# EAGLE design carteMere (EAGLE 5.10)
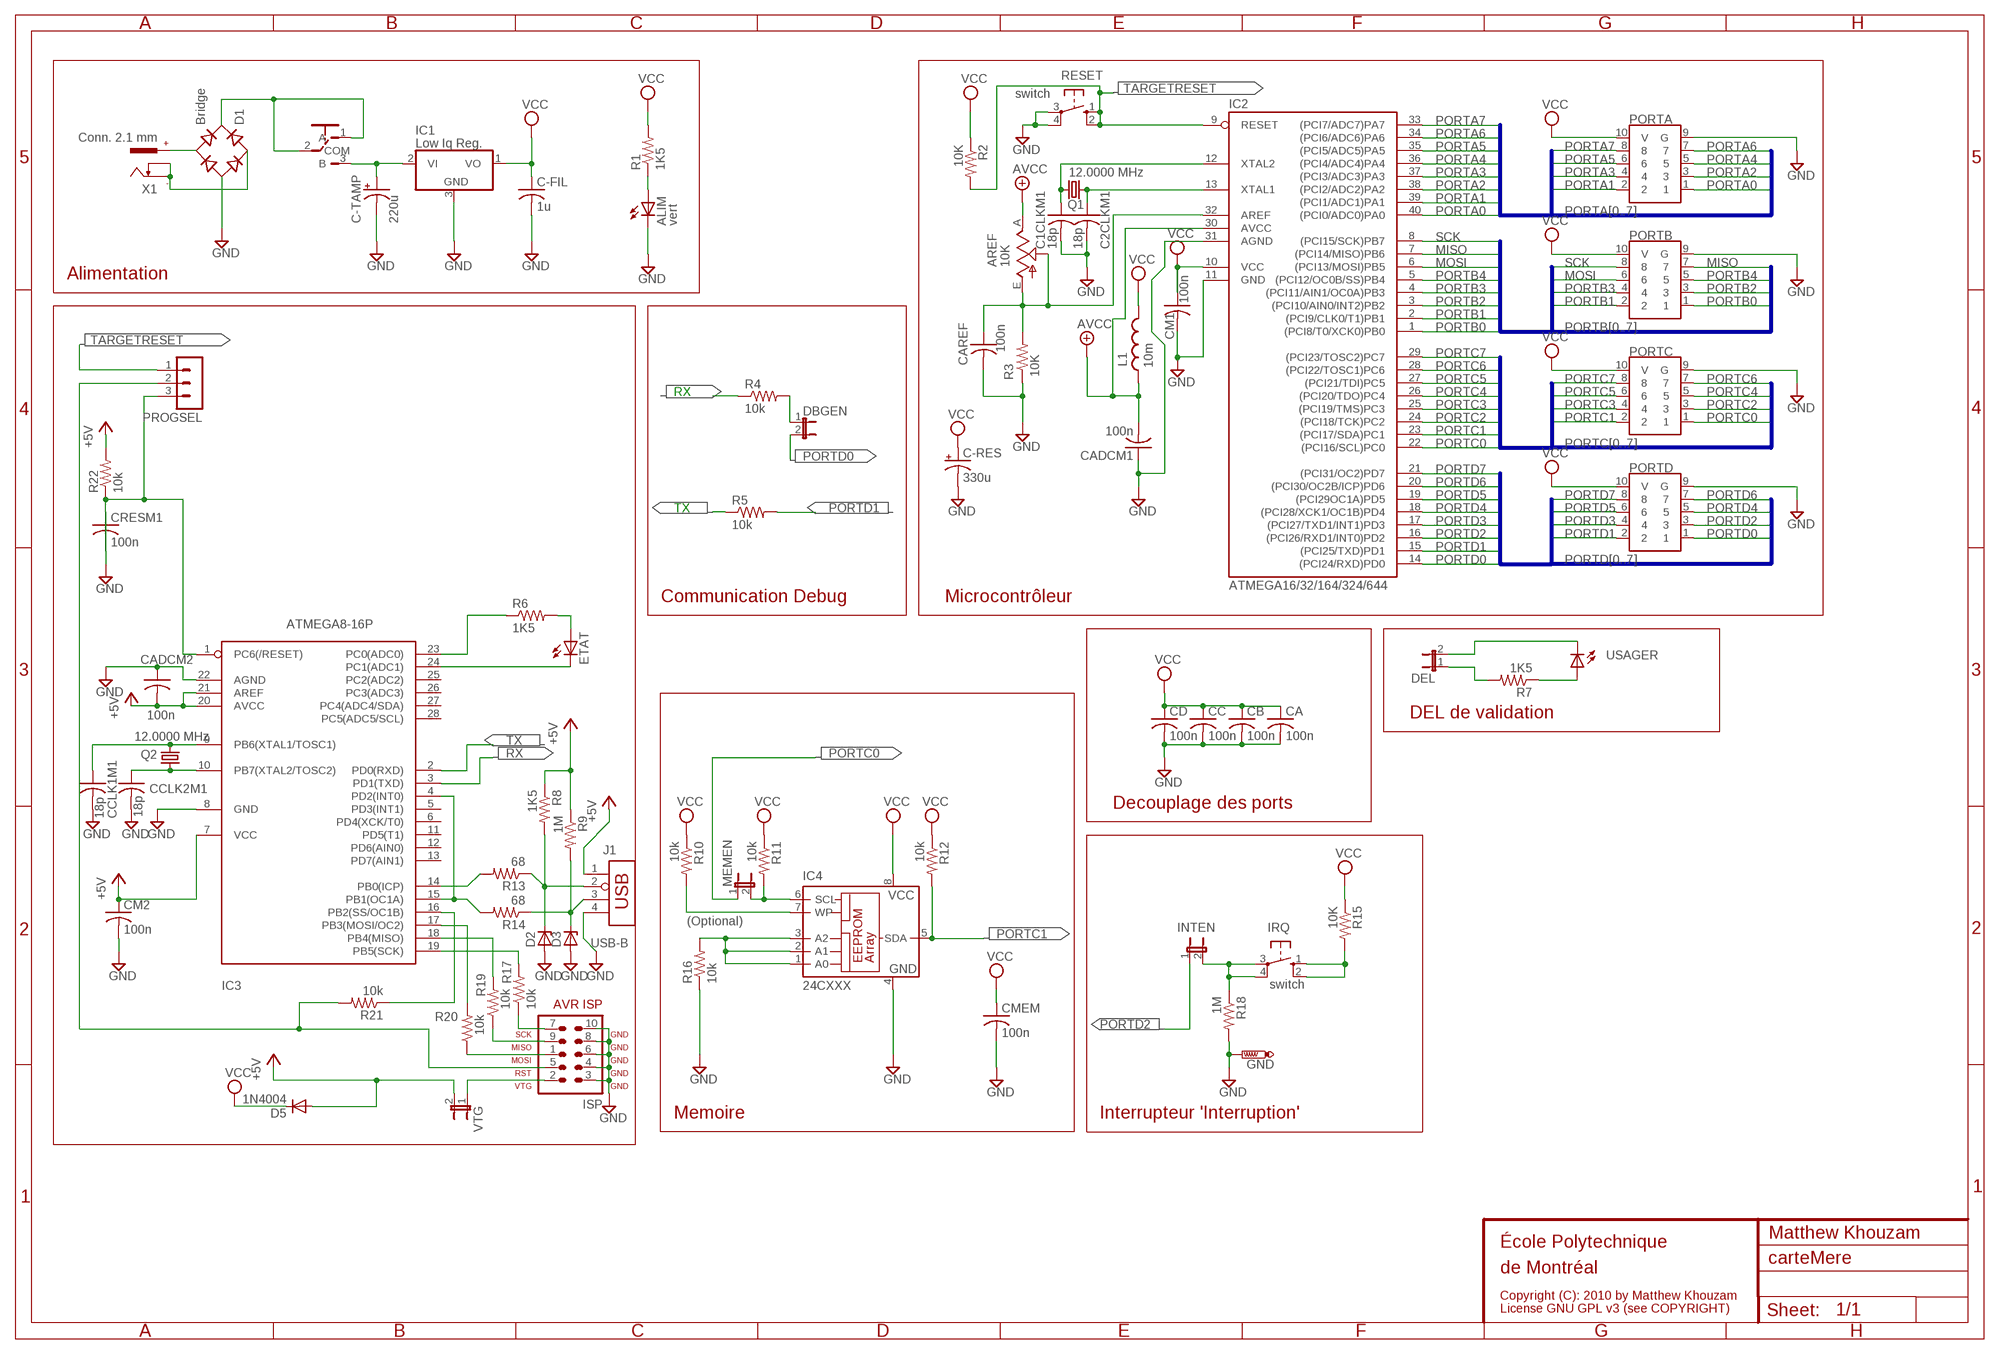
[diagram p0: schematic, sheet 1]

## Parts
ALIM  vert  LED5MM  [LED5MM]
AREF  10K  PV37SPEC  [S64Y]
C1CLKM1  18p  C-US050-035X075  [C050-035X075]
C2CLKM1  18p  C-US050-035X075  [C050-035X075]
C-FIL  1u  C-US050-035X075  [C050-035X075]
C-RES  330u  CPOL-USE2.5-7  [E2,5-7]
C-TAMP  220u  CPOL-USE3.5-8  [E3,5-8]
CA  100n  C-US050-035X075  [C050-035X075]
CADCM1  100n  C-US050-035X075  [C050-035X075]
CADCM2  100n  C-US050-035X075  [C050-035X075]
CAREF  100n  C-US050-035X075  [C050-035X075]
CB  100n  C-US050-035X075  [C050-035X075]
CC  100n  C-US050-035X075  [C050-035X075]
CCLK1M1  18p  C-US050-035X075  [C050-035X075]
CCLK2M1  18p  C-US050-035X075  [C050-035X075]
CD  100n  C-US050-035X075  [C050-035X075]
CM1  100n  C-US050-035X075  [C050-035X075]
CM2  100n  C-US050-035X075  [C050-035X075]
CMEM  100n  C-US050-035X075  [C050-035X075]
CRESM1  100n  C-US050-035X075  [C050-035X075]
D1  Bridge  RECTIFIER-DIL  [B-DIL]
D2  ZENER-DIODEDO35Z10  [DO35Z10]
D3  ZENER-DIODEDO35Z10  [DO35Z10]
D5  1N4004  [DO41-10]
DBGEN  JP1E  [JP1]
DEL  JP1E  [JP1]
ETAT  Bi-dir  LED5MM  [LED5MM]
GND  PTR1PAD1-13  [P1-13]
IC1  Low Iq Reg.  LP8345-50  [TO252]
IC2  ATMEGA16/32/164/324/644  ATMEGA324-20P  [DIL40]
IC3  ATMEGA8-16P  [DIL28-3]
IC4  24CXXX  24AA256P  [DIL8]
INTEN  JP1E  [JP1]
IRQ  switch  10-XX  [B3F-10XX]
ISP  AVR-ISP-10  [AVR-ISP-10]
J1  USB-B  [USB-B]
L1  10m  L-US0207/12  [0207/12]
MEMEN  JP1E  [JP1]
OFF/ON  EG1218  [3DIL]
PORTA  DATAPORT  [5X2]
PORTB  DATAPORT  [5X2]
PORTC  DATAPORT  [5X2]
PORTD  DATAPORT  [5X2]
PROGSEL  MA03-1  [MA03-1]
Q1  12.0000 MHz  CRYSTALHC49S  [HC49/S]
Q2  12.0000 MHz  CRYSTALHC49S  [HC49/S]
R1  1K5  R-US_0207/7  [0207/7]
R2  10K  R-US_0207/7  [0207/7]
R3  10K  R-US_0207/7  [0207/7]
R4  10k  R-US_0207/7  [0207/7]
R5  10k  R-US_0204/7  [0204/7]
R6  1K5  R-US_0207/7  [0207/7]
R7  1K5  R-US_0207/7  [0207/7]
R8  1K5  R-US_0207/7  [0207/7]
R9  1M  R-US_0207/7  [0207/7]
R10  10k  R-US_0207/7  [0207/7]
R11  10k  R-US_0207/7  [0207/7]
R12  10k  R-US_0207/7  [0207/7]
R13  68  R-US_0207/7  [0207/7]
R14  68  R-US_0207/7  [0207/7]
R15  10K  R-US_0207/7  [0207/7]
R16  10k  R-US_0207/7  [0207/7]
R17  10k  R-US_0204/7  [0204/7]
R18  1M  R-US_0207/7  [0207/7]
R19  10k  R-US_0204/7  [0204/7]
R20  10k  R-US_0204/7  [0204/7]
R21  10k  R-US_0204/7  [0204/7]
R22  10k  R-US_0207/7  [0207/7]
RESET  switch  10-XX  [B3F-10XX]
USAGER  Bi-dir  LED5MM  [LED5MM]
VTG  JP1E  [JP1]
X1  Conn. 2.1 mm  POWER21  [POWER21]

## Nets
+5V: CADCM2.2 CM2.1 D5.A IC3.7(VCC) IC3.20(AVCC) IC3.21(AREF) J1.1 R8.1 R9.1 R22.2 VTG.2
AVCC: AREF.A CADCM1.2 IC2.30(AVCC) L1.1
AVRRESET: IC3.16(PB2(SS/OC1B)) R21.1
D+: D3.C J1.3 R9.2 R14.1
D-: D2.C J1.2 R8.2 R13.1
DIAGLEG: R7.1 USAGER.A
DIODESW: D1.+ OFF/ON.1(A) OFF/ON.2(COM)
GND: ALIM.K(C) C1CLKM1.2 C2CLKM1.2 C-FIL.2 C-RES.- C-TAMP.- CA.2 CADCM1.1 CADCM2.1 CAREF.2 CB.2 CC.2 CCLK1M1.2 CCLK2M1.2 CD.2 CM1.2 CM2.2 CMEM.2 CRESM1.1 D1.- D2.A D3.A GND.1(TP) IC1.3(GND) IC2.11(GND) IC2.31(AGND) IC3.8(GND) IC3.22(AGND) IC4.4(GND) ISP.3 ISP.4 ISP.6 ISP.8 ISP.10 J1.4 PORTA.9(G) PORTB.9(G) PORTC.9(G) PORTD.9(G) R3.1 R16.1 R18.2 RESET.3(P) RESET.4(P1)
INTSW: IRQ.1(S) IRQ.2(S1) R15.2
INTSW2: INTEN.2 IRQ.3(P) IRQ.4(P1) R18.1
LEDTEST: DEL.2 USAGER.K(C)
MEGAAREF: AREF.E(B) AREF.S(W) CAREF.1 IC2.32(AREF) R3.2
MEGAXTAL1: C2CLKM1.1 IC2.13(XTAL1) Q1.2
MEGAXTAL2: C1CLKM1.1 IC2.12(XTAL2) Q1.1
MISO: IC2.7((PCI14/MISO)PB6) ISP.9 PORTB.7 R19.1
MISOUSB: IC3.18(PB4(MISO)) R19.2
MOSI: IC2.6((PCI13/MOSI)PB5) ISP.1 PORTB.6 R20.1
MOSIUSB: IC3.17(PB3(MOSI/OC2)) R20.2
N$8: CCLK2M1.1 IC3.10(PB7(XTAL2/TOSC2)) Q2.1
N$9: CCLK1M1.1 IC3.9(PB6(XTAL1/TOSC1)) Q2.2
N$12: IC4.1(A0) IC4.2(A1) IC4.3(A2) R16.2
N$17: ETAT.A R6.2
N$18: ETAT.K(C) IC3.24(PC1(ADC1))
N$19: IC3.23(PC0(ADC0)) R6.1
N$20: IC4.7(WP) R10.2
PORTA0: IC2.40((PCI0/ADC0)PA0) PORTA.1
PORTA1: IC2.39((PCI1/ADC1)PA1) PORTA.2
PORTA2: IC2.38((PCI2/ADC2)PA2) PORTA.3
PORTA3: IC2.37((PCI3/ADC3)PA3) PORTA.4
PORTA4: IC2.36((PCI4/ADC4)PA4) PORTA.5
PORTA5: IC2.35((PCI5/ADC5)PA5) PORTA.6
PORTA6: IC2.34((PCI6/ADC6)PA6) PORTA.7
PORTA7: IC2.33((PCI7/ADC7)PA7) PORTA.8
PORTB0: IC2.1((PCI8/T0/XCK0)PB0) PORTB.1
PORTB1: IC2.2((PCI9/CLK0/T1)PB1) PORTB.2
PORTB2: IC2.3((PCI10/AIN0/INT2)PB2) PORTB.3
PORTB3: IC2.4((PCI11/AIN1/OC0A)PB3) PORTB.4
PORTB4: IC2.5((PCI12/OC0B/SS)PB4) PORTB.5
PORTC0: IC2.22((PCI16/SCL)PC0) MEMEN.1 PORTC.1
PORTC1: IC2.23((PCI17/SDA)PC1) IC4.5(SDA) PORTC.2 R12.2
PORTC2: IC2.24((PCI18/TCK)PC2) PORTC.3
PORTC3: IC2.25((PCI19/TMS)PC3) PORTC.4
PORTC4: IC2.26((PCI20/TDO)PC4) PORTC.5
PORTC5: IC2.27((PCI21/TDI)PC5) PORTC.6
PORTC6: IC2.28((PCI22/TOSC1)PC6) PORTC.7
PORTC7: IC2.29((PCI23/TOSC2)PC7) PORTC.8
PORTD0: DBGEN.2 IC2.14((PCI24/RXD)PD0) PORTD.1
PORTD1: IC2.15((PCI25/TXD)PD1) PORTD.2 R5.2
PORTD2: IC2.16((PCI26/RXD1/INT0)PD2) INTEN.1 PORTD.3
PORTD3: IC2.17((PCI27/TXD1/INT1)PD3) PORTD.4
PORTD4: IC2.18((PCI28/XCK1/OC1B)PD4) PORTD.5
PORTD5: IC2.19((PCI29OC1A)PD5) PORTD.6
PORTD6: IC2.20((PCI30/OC2B/ICP)PD6) PORTD.7
PORTD7: IC2.21((PCI31/OC2)PD7) PORTD.8
PRGRESET: CRESM1.2 IC3.1(PC6(/RESET)) PROGSEL.3 R22.1
PWRLED: ALIM.A R1.1
RXD: IC3.2(PD0(RXD)) R5.1
SCK: IC2.8((PCI15/SCK)PB7) ISP.7 PORTB.8 R17.1
SCKUSB: IC3.19(PB5(SCK)) R17.2
SCL: IC4.6(SCL) MEMEN.2 R11.2
SYSRST: ISP.5 PROGSEL.2 R21.2
TARGETRESET: IC2.9(RESET) PROGSEL.1 R2.2 RESET.1(S) RESET.2(S1)
TL3: DEL.1 R7.2
TX: DBGEN.1 R4.2
TXD: IC3.3(PD1(TXD)) R4.1
USB+: IC3.4(PD2(INT0)) IC3.15(PB1(OC1A)) R14.2
USB-: IC3.14(PB0(ICP)) R13.2
VCC: C-FIL.1 C-RES.+ CA.1 CB.1 CC.1 CD.1 CM1.1 CMEM.1 D5.C IC1.1(VO) IC2.10(VCC) IC4.8(VCC) L1.2 PORTA.10(V) PORTB.10(V) PORTC.10(V) PORTD.10(V) R1.2 R2.1 R10.1 R11.1 R12.1 R15.1
VIN+: D1.AC2 X1.+
VIN-: D1.AC1 X1.- X1.C
VTG: ISP.2 VTG.1
VUNREG: C-TAMP.+ IC1.2(VI) OFF/ON.3(B)
Unconnected: IC3.5(PD3(INT1)) IC3.6(PD4(XCK/T0)) IC3.11(PD5(T1)) IC3.12(PD6(AIN0)) IC3.13(PD7(AIN1)) IC3.25(PC2(ADC2)) IC3.26(PC3(ADC3)) IC3.27(PC4(ADC4/SDA)) IC3.28(PC5(ADC5/SCL))

## Buses
PORTA[0..7]
PORTB[0..7]
PORTC[0..7]
PORTD[0..7]

## Notes on the sheet
- Alimentation
- RX
- TX
- Communication Debug | Microcontrôleur
- DEL de validation
- TX
- RX
- Decouplage des ports
- (Optional)
- Memoire | Interrupteur 'Interruption'
- Matthew Khouzam
- École Polytechnique
- de Montréal
- Copyright (C): 2010 by Matthew Khouzam
- License GNU GPL v3 (see COPYRIGHT)

## Library data of the parts
ALIM ETAT USAGER = led:LED: LED OSRAM: - CHIPLED LG R971, LG N971, LY N971, LG Q971, LY Q971, LO R971, LY R971 LH N974, LH R974 LS Q976, LO Q976, LY Q976 LO Q996 - Hyper CHIPLED LW Q18S LB Q993, LB Q99A, LB R99A - SideLED LS A670, LO A670, LY A670, LG A670, LP A670 LB A673, LV A673, LT A673, LW A673 LH A674 LY A675 LS A676, LA A676, LO A676, LY A676, LW A676 LS A679, LY A679, LG A679 - Hyper Micro SIDELED® LS Y876, LA Y876, LO Y876, LY Y876 LT Y87S - SmartLED LW L88C, LW L88S LB L89C, LB L89S, LG L890 LS L89K, LO L89K, LY L89K LS L896, LA L896, LO L896, LY L896 - TOPLED LS T670, LO T670, LY T670, LG T670, LP T670 LSG T670, LSP T670, LSY T670, LOP T670, LYG T670 LG T671, LOG T671, LSG T671 LB T673, LV T673, LT T673, LW T673 LH T674 LS T676, LA T676, LO T676, LY T676, LB T676, LH T676, LSB T676, LW T676 LB T67C, LV T67C, LT T67C, LS T67K, LO T67K, LY T67K, LW E67C LS E67B, LA E67B, LO E67B, LY E67B, LB E67C, LV E67C, LT E67C LW T67C LS T679, LY T679, LG T679 LS T770, LO T770, LY T770, LG T770, LP T770 LB T773, LV T773, LT T773, LW T773 LH T774 LS E675, LA E675, LY E675, LS T675 LS T776, LA T776, LO T776, LY T776, LB T776 LHGB T686 LT T68C, LB T68C - Hyper Mini TOPLED® LB M676 - Mini TOPLED Santana® LG M470 LS M47K, LO M47K, LY M47K Source: http://www.osram.convergy.de/
AREF = mblbr:PV37: Potentiomètre Murata série PV37
C1CLKM1 C2CLKM1 C-FIL CA CADCM1 CADCM2 CAREF CB CC CCLK1M1 CCLK2M1 CD CM1 CM2 CMEM CRESM1 = mblbr:C-US: CAPACITOR, American symbol
C-RES C-TAMP = rcl:CPOL-US: POLARIZED CAPACITOR, American symbol
D1 = rectifier:RECTIFIER-: Rectifier
D2 D3 = diode:ZENER-DIODE: Z-Diode
D5 = diode:1N4004: DIODE general purpose rectifier, 1 A
DBGEN DEL INTEN MEMEN VTG = jumper:JP1E: JUMPER
GND = testpad:PTR1: TEST PIN
IC1 = lp8345:LP8345-50
IC2 = avr:ATMEGA324*P: MICROCONTROLLER 32 kBytes FLASH 2 kBytes SRAM 1 kBytes EEPROM DUAL USART 8-channel 10 bit ADC
IC3 = avr:ATMEGA8*P: MICROCONTROLLER 8 Kbytes FLASH 1 kbytes SRAM 512 bytes EEPROM USART 4-channel 10 bit ADC 2-channel 8 bit ADC
IC4 = microchip:24*: Serial EEPROM I2C
IRQ RESET = mblbr:10-XX: OMRON SWITCH
ISP = atmel:AVR-ISP-10: AVR ISP-10 Serial Programming Header
J1 = mblbr:USB-B: USB Type B connector ASSMANN Electronics
L1 = rcl:L-US: INDUCTOR, American symbol
OFF/ON = eswitch:EG1218
PORTA PORTB PORTC PORTD = Connector:DATAPORT: this is a dataport Matthew Khouzam 2005
PROGSEL = con-lstb:MA03-1: PIN HEADER
Q1 Q2 = mblbr:CRYSTAL: CRYSTAL
R1-R22 = mblbr:R-US_: RESISTOR, American symbol
X1 = tennessee:POWER21: CONNECTOR

## Board
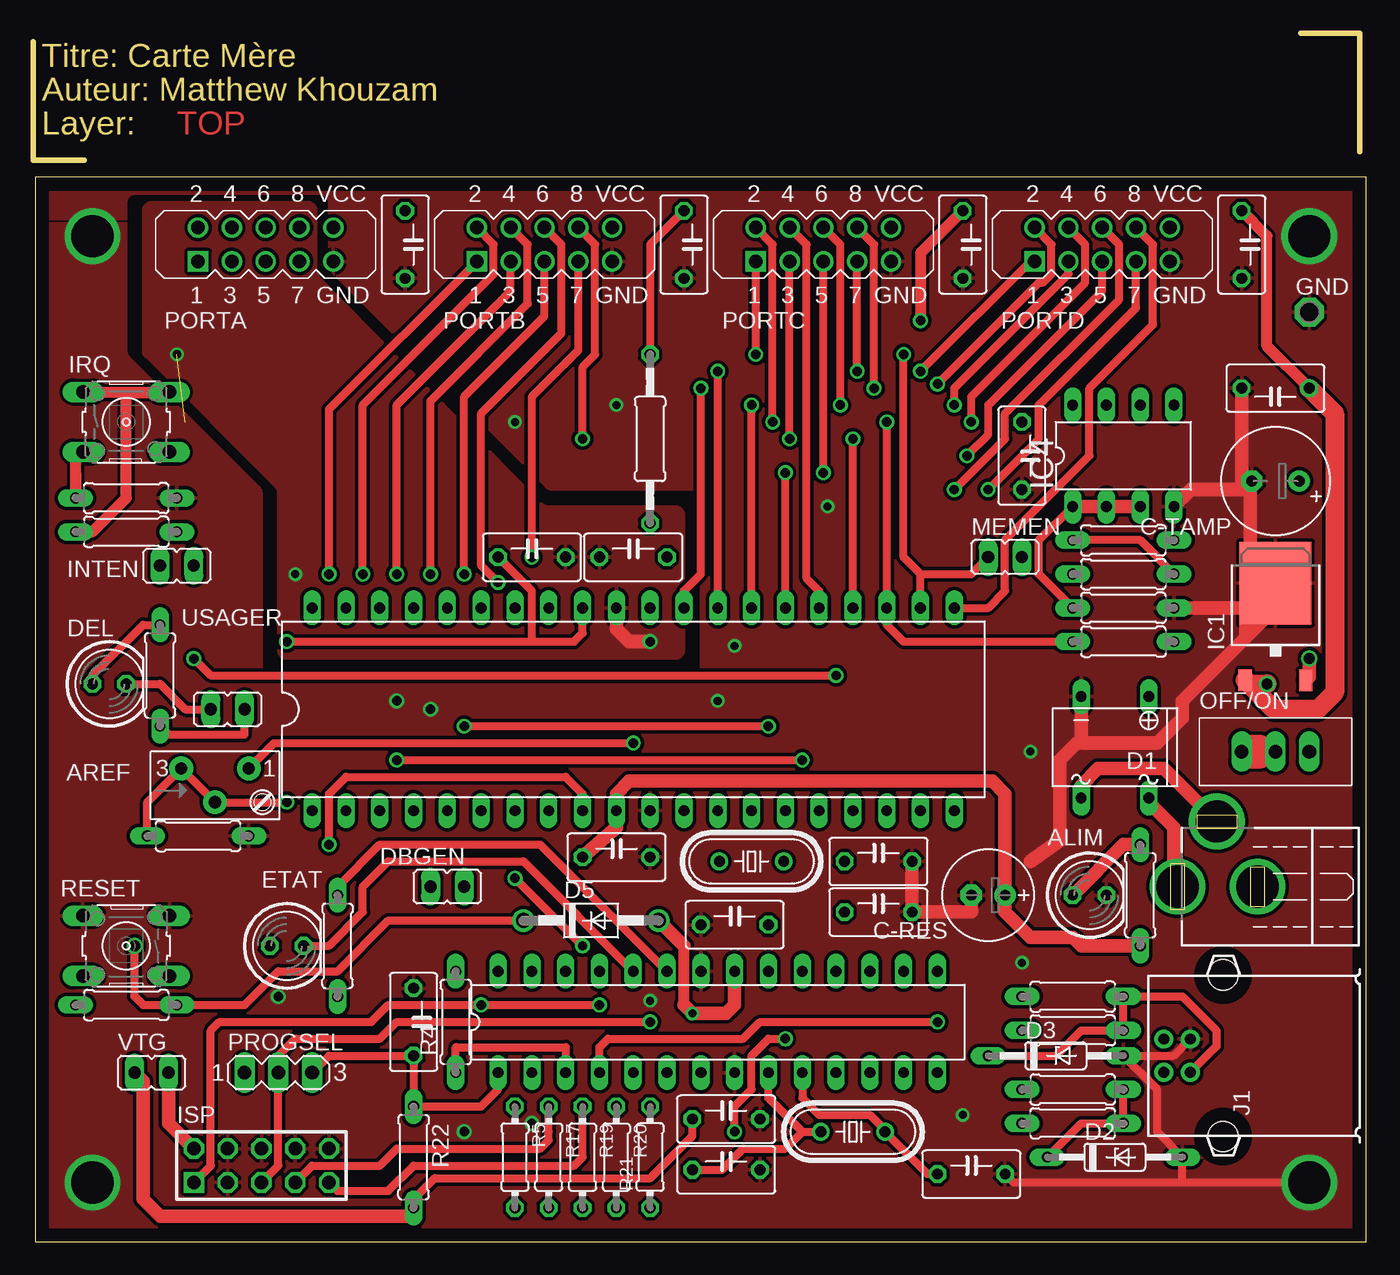
[diagram p1: board, top side]
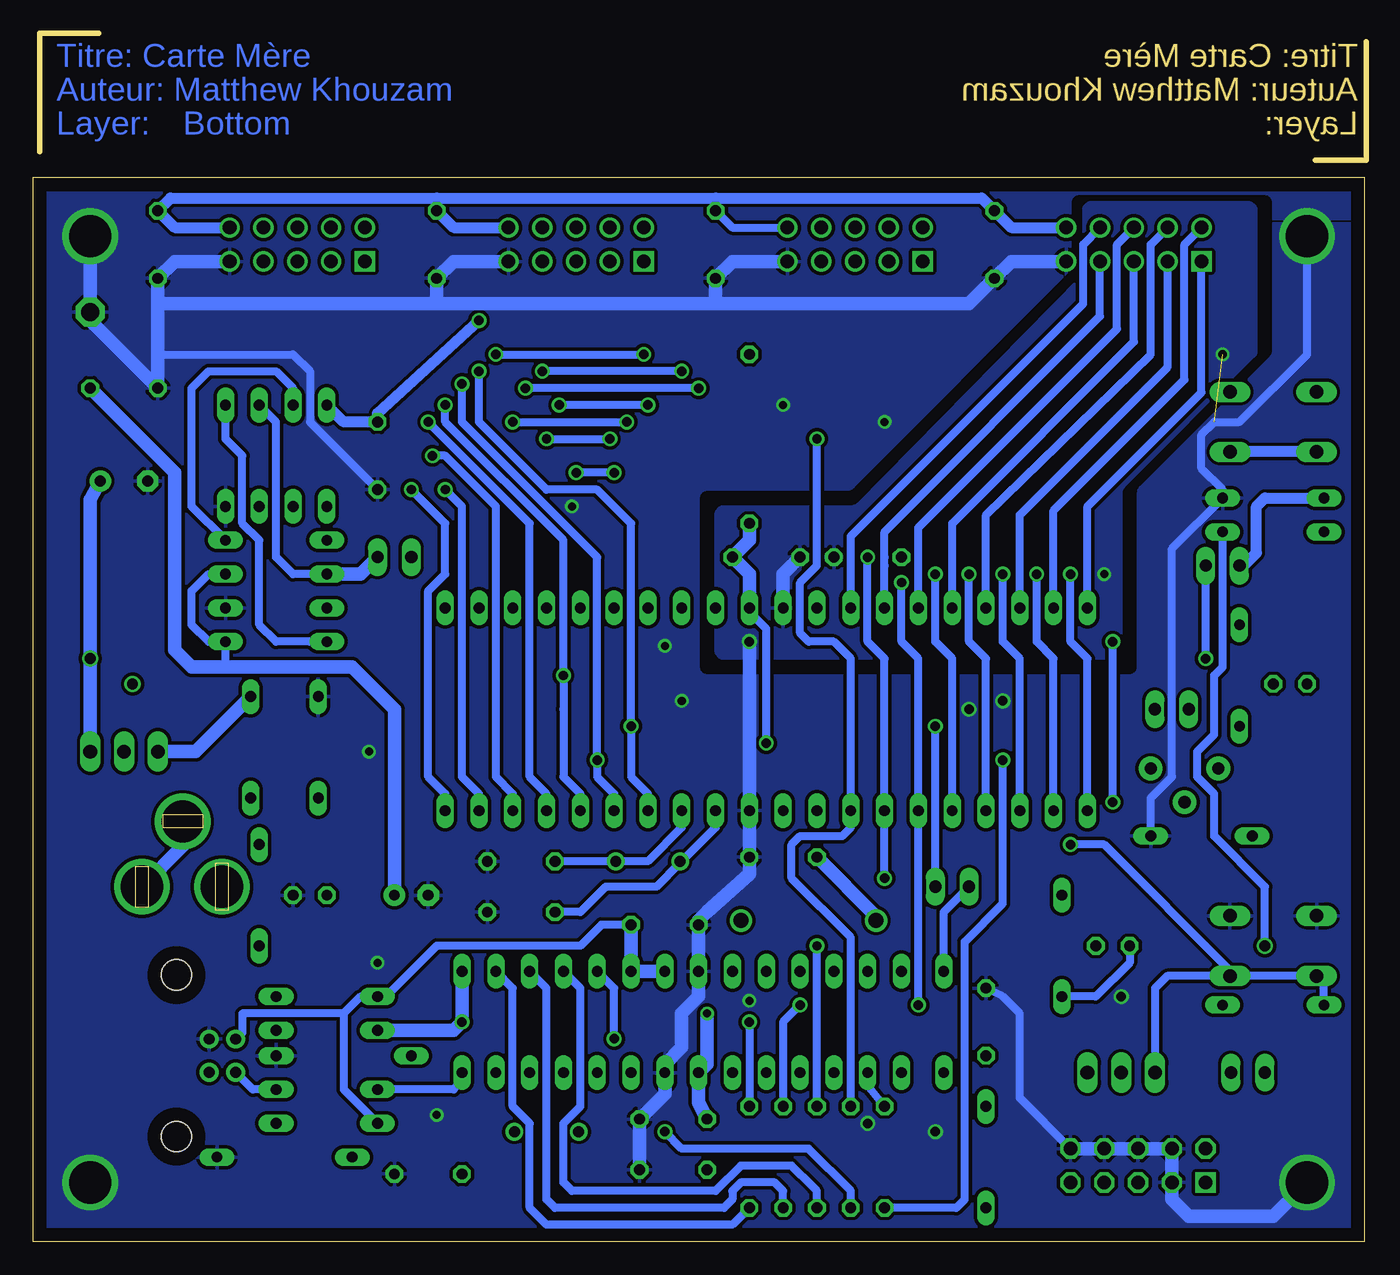
[diagram p2: board, bottom side, seen from below]

Size 100.17 x 90.8 mm. Coordinates in mm from the lower left corner, seen from the top.
Outline: 0,90.16 0,81.27 3.81,81.27
Outline: 99.7,81.91 99.7,90.8 95.25,90.8
Outline: 0.17,0 100.17,0 100.17,80 0.17,80 0.17,0
Copper layers (1*16): Top 0.035mm / dielectric 1.5mm / Bottom 0.035mm
Design rules "default *": minimum track width 10mil, minimum drill 24mil, track to track 6mil, track to pad 6mil, pad to pad 6mil, via to via 6mil, smd to smd 8mil, copper to edge 40mil, drill to drill 8mil, minimum pad ring 10mil, minimum via ring 8mil, stop-mask expansion 4mil, vias tented up to drill 0mil, thermal gap 10mil

### Footprints (pad centres in the part's own frame; a part is rotated, then mirrored left to right if it is on the bottom)
LED5MM = drill 0.813 octagon: A -1.27,0; K 1.27,0
S64Y = drill 0.914 pad 1.778 round: A 2.54,1.27; E -2.54,1.27; S 0,-1.27
C050-035X075 = drill 0.813 octagon: 1 -2.54,0; 2 2.54,0
E2,5-7 = drill 0.813 pad 1.6 round: + -1.27,0 | drill 0.813 pad 1.6 octagon: - 1.27,0
E3,5-8 = drill 0.813 pad 1.6 round: + -1.778,0 | drill 0.813 pad 1.6 octagon: - 1.778,0
B-DIL@1 = drill 0.813 long: + -2.54,-3.81; - 2.54,-3.81; AC1 2.54,3.81; AC2 -2.54,3.81
DO35Z10 = drill 0.813 long: A 5.08,0; C -5.08,0
DO41-10 = drill 1.118 round: A 5.08,0; C -5.08,0
JP1 = drill 0.914 long: 1 0,-1.27; 2 0,1.27
P1-13 = drill 1.321 pad 2.159 octagon: 1 0,0
TO252 = smd 1 x 1.6: 1 -2.28,-4.8; 2 2.28,-4.8 | smd 5.4 x 6.2: 3 0,2.5
DIL40 = drill 0.813 long: 1 -24.13,-7.62; 2 -21.59,-7.62; 3 -19.05,-7.62; 4 -16.51,-7.62; 5 -13.97,-7.62; 6 -11.43,-7.62; 7 -8.89,-7.62; 8 -6.35,-7.62; 9 -3.81,-7.62; 10 -1.27,-7.62; 11 1.27,-7.62; 12 3.81,-7.62; 13 6.35,-7.62; 14 8.89,-7.62; 15 11.43,-7.62; 16 13.97,-7.62; 17 16.51,-7.62; 18 19.05,-7.62; 19 21.59,-7.62; 20 24.13,-7.62; 21 24.13,7.62; 22 21.59,7.62; 23 19.05,7.62; 24 16.51,7.62; 25 13.97,7.62; 26 11.43,7.62; 27 8.89,7.62; 28 6.35,7.62; 29 3.81,7.62; 30 1.27,7.62; 31 -1.27,7.62; 32 -3.81,7.62; 33 -6.35,7.62; 34 -8.89,7.62; 35 -11.43,7.62; 36 -13.97,7.62; 37 -16.51,7.62; 38 -19.05,7.62; 39 -21.59,7.62; 40 -24.13,7.62
DIL28-3 = drill 0.813 long: 1 -16.51,-3.81; 2 -13.97,-3.81; 3 -11.43,-3.81; 4 -8.89,-3.81; 5 -6.35,-3.81; 6 -3.81,-3.81; 7 -1.27,-3.81; 8 1.27,-3.81; 9 3.81,-3.81; 10 6.35,-3.81; 11 8.89,-3.81; 12 11.43,-3.81; 13 13.97,-3.81; 14 16.51,-3.81; 15 16.51,3.81; 16 13.97,3.81; 17 11.43,3.81; 18 8.89,3.81; 19 6.35,3.81; 20 3.81,3.81; 21 1.27,3.81; 22 -1.27,3.81; 23 -3.81,3.81; 24 -6.35,3.81; 25 -8.89,3.81; 26 -11.43,3.81; 27 -13.97,3.81; 28 -16.51,3.81
DIL8 = drill 0.813 long: 1 -3.81,-3.81; 2 -1.27,-3.81; 3 1.27,-3.81; 4 3.81,-3.81; 5 3.81,3.81; 6 1.27,3.81; 7 -1.27,3.81; 8 -3.81,3.81
B3F-10XX = drill 1.016 long: 1 -3.251,2.261; 2 3.251,2.261; 3 -3.251,-2.261; 4 3.251,-2.261
AVR-ISP-10 = drill 1.016 square: 1 -5.08,-1.27 | drill 1.016 octagon: 2 -5.08,1.27; 3 -2.54,-1.27; 4 -2.54,1.27; 5 0,-1.27; 6 0,1.27; 7 2.54,-1.27; 8 2.54,1.27; 9 5.08,-1.27; 10 5.08,1.27
USB-B = drill 0.813 pad 1.422 round: 1 1.25,8.39; 2 -1.25,8.39; 3 -1.25,6.39; 4 1.25,6.39 | hole 2.286: -6.07,3.93; 6.07,3.93
0207/12 = drill 0.813 octagon: 1 -6.35,0; 2 6.35,0
3DIL = drill 1.016 long: 1 -2.54,0; 2 0,0; 3 2.54,0
5X2 = drill 1.016 square: 1 -5.08,-1.27 | drill 1.016 round: 2 -5.08,1.27; 3 -2.54,-1.27; 4 -2.54,1.27; 5 0,-1.27; 6 0,1.27; 7 2.54,-1.27; 8 2.54,1.27; 9 5.08,-1.27; 10 5.08,1.27
MA03-1 = drill 1.016 long: 1 -2.54,0; 2 0,0; 3 2.54,0
HC49/S = drill 0.813 round: 1 -2.413,0; 2 2.413,0
0207/7 = drill 0.813 long: 1 -3.81,0; 2 3.81,0
0204/7 = drill 0.813 octagon: 1 -3.81,0; 2 3.81,0
POWER21 = drill 3.175 round: + 0,7.35; - 0,1.35; C 4.9,4.4

### Placement (x,y rotation side)
ALIM  79.38,26.03 0 top
AREF  13.65,34.29 0 top
C1CLKM1  63.5,24.76 0 top
C2CLKM1  63.5,28.57 0 top
C-FIL  93.34,64.13 180 top
C-RES  71.76,26.03 180 top
C-TAMP  93.34,57.15 180 top
CA  27.94,74.92 270 top
CADCM1  45.09,51.43 0 top
CADCM2  52.7,23.81 0 top
CAREF  37.46,51.43 0 top
CB  48.89,74.92 270 top
CC  69.85,74.92 270 top
CCLK1M1  52.07,5.39 0 top
CCLK2M1  70.48,5.08 0 top
CD  90.81,74.92 270 top
CM1  43.81,28.89 0 top
CM2  52.07,9.2 0 top
CMEM  74.3,59.05 270 top
CRESM1  28.58,16.5 270 top
D1  Bridge  [B-DIL@1]  81.28,37.14 180 top
D2  81.28,6.34 0 top
D3  76.84,13.97 0 top
D5  41.91,24.12 0 top
DBGEN  31.12,26.66 270 top
DEL  14.61,40 90 top
DRILEGEND  [DRILEGEND]  106.68,76.83 0 top  (outside the outline)
ETAT  19.05,22.22 0 top
GND  95.89,69.84 0 top
IC1  93.34,46.98 0 top
IC2  45.09,40 0 top
IC3  51.43,16.5 0 top
IC4  81.92,59.05 0 top
INTEN  10.79,50.8 90 top
IRQ  6.98,61.59 0 top
ISP  17.15,5.71 0 top
J1  93.34,13.97 90 top
L1  46.35,60.32 90 top
MEMEN  73.03,51.43 270 top
OFF/ON  93.34,36.83 0 top
PORTA  17.46,74.92 0 top
PORTB  38.42,74.92 0 top
PORTC  59.37,74.92 0 top
PORTD  80.33,74.92 0 top
PROGSEL  18.42,12.7 0 top
Q1  53.98,28.57 0 top
Q2  61.59,8.25 180 top
R1  83.19,26.03 270 top
R2  6.98,17.77 180 top
R3  12.38,30.47 180 top
R4  31.75,16.5 90 top
R5  36.2,6.34 270 top
R6  22.86,22.22 270 top
R7  9.53,42.54 270 top
R8  78.11,8.89 0 top
R9  78.11,18.41 0 top
R10  81.92,52.7 0 top
R11  81.92,50.16 180 top
R12  81.92,45.08 180 top
R13  78.11,11.43 180 top
R14  78.11,15.87 180 top
R15  6.98,53.34 180 top
R16  81.92,47.62 180 top
R17  38.73,6.34 270 top
R18  6.98,55.88 0 top
R19  41.27,6.34 270 top
R20  43.81,6.34 270 top
R21  46.35,6.34 90 top
R22  28.58,6.34 270 top
RESET  6.98,22.22 180 top
USAGER  5.71,41.91 0 top
VTG  8.89,12.7 90 top
X1  93.34,26.66 90 top

### Tracks (layer width: path | path; a pad name or v marks a point on that pad's centre or on a via)
+5V  (via drill 0.6)
  Top 0.61: CM2.1 49.53,7.93 46.35,4.76 30.16,4.76 28.58,3.17 R22.2
  Top 0.813: 48.89,17.77 48.89,22.22
  Top 1.016: IC3.21 52.7,17.77 52.07,17.14 v49.53,17.14 48.89,17.77 | VTG.2 8.26,12.06 8.26,3.17 9.53,1.9 28.58,1.9 R22.2 | 48.89,22.22 D5.A
  Bottom 0.61: J1.1 84.45,15.72 84.45,17.14 76.84,17.14 | 76.84,17.14 75.57,18.41 R9.1 73.66,18.41 69.85,22.22 59.05,22.22 57.47,23.81 CADCM2.2 | R8.1 76.84,11.43 76.84,17.14
  Bottom 1.016: CADCM2.2 IC3.20 IC3.21 | CM2.1 50.16,10.47 IC3.7 49.53,13.33 v49.53,17.14
AVCC  (via drill 0.71)
  Top 0.61: AREF.A 18.1,37.46 v45.09,37.46
  Bottom 0.61: IC2.30 46.35,47.3 45.09,46.03 v45.09,37.46
  Bottom 1.016: L1.1 46.35,52.7 CADCM1.2 46.35,50.16 IC2.30
AVRRESET
  Bottom 0.61: IC3.16 64.14,19.04 64.14,10.16 62.86,8.89 62.86,2.54 61.59,1.27 47.62,1.27 R21.1
D+
  Top 0.61: D3.C 76.84,13.97 78.74,15.87 R14.1 R9.2 86.36,18.41 88.9,15.87 88.9,14.66 J1.3
D-
  Top 0.61: R8.2 R13.1 R8.2 | R8.2 78.74,8.89 D2.C
  Bottom 0.61: J1.2 83.67,11.43 R13.1
DIAGLEG
  Top 0.61: USAGER.A 4.45,42.54 8.26,46.35 R7.1
DIODESW
  Top 1.016: OFF/ON.1 91.44,36.83 | 92.08,36.83 OFF/ON.2
  Top 2.54: 91.44,36.83 92.08,36.83
  Bottom 1.016: D1.+ 87.95,36.83 OFF/ON.1
GND  (via drill 0.61, 0.71, 3.17)  (1 unrouted)
  Top 0.61: J1.4 85.7,13.97 D3.A 84.45,11.43 84.45,8.25 D2.A 86.36,4.44 | 86.36,4.44 v95.89,4.44 | CCLK2M1.2 73.66,4.44 86.36,4.44
  Top 1.016: IC1.3 91.44,50.76 91.44,56.51 | 91.44,56.51 90.81,57.15 C-FIL.2 | v46.35,45.08 44.77,45.08 43.81,46.03 IC2.31 | 78.74,37.46 78.42,37.46 77.15,36.19 77.15,30.16 74.93,28.57 | 78.74,37.46 84.45,37.46 86.36,39.37 86.36,40.64 91.28,45.56 | IC1.3 93.34,48.89 | 91.28,45.56 93.34,47.62 IC1.3 | R16.1 92.08,47.62 91.12,46.67 91.12,45.72 91.28,45.56 | 91.44,56.51 C-TAMP.- | IC4.4 87,56.51 91.44,56.51 | C-RES.- 70.48,24.76 C1CLKM1.2 C2CLKM1.2 | 78.74,37.46 D1.-
  Bottom 0.61: R3.1 16.19,33.33 14.61,34.92 14.61,52.07 R18.2 10.79,56.51 12.38,58.1 12.38,60.64 11.43,61.59 9.53,61.59 4.45,66.67 v4.45,75.56 | CMEM.2 79.38,61.59 79.38,65.4 80.65,66.67 90.81,66.67 | ISP.10 26.04,10.79 26.04,17.14 27.31,18.41 CRESM1.1
  Bottom 1.016: GND.1 96.2,69.84 96.2,69.53 95.89,69.21 | 95.89,69.21 GND.1 | 95.89,69.21 C-FIL.2 90.81,66.67 90.81,70.48 | 90.81,70.48 CD.2 89.54,73.66 PORTD.9 | PORTA.9 26.67,73.66 CA.2 29.85,70.48 48.89,70.48 | 48.89,70.48 69.85,70.48 | 69.85,70.48 90.81,70.48 | 69.85,70.48 CC.2 68.58,73.66 PORTC.9 | PORTB.9 47.62,73.66 CB.2 48.89,70.48 | IC2.31 43.81,50.16 CADCM1.1 | CCLK1M1.2 CM2.2 52.7,11.11 IC3.8 52.7,13.33 51.43,14.6 51.43,17.14 50.16,18.41 IC3.22 CADCM2.1 50.16,24.12 49.53,24.76 46.35,27.62 CM1.2 IC2.11 v46.35,45.08 | ISP.10 ISP.8 ISP.6 ISP.4 ISP.3 14.61,3.17 13.33,1.9 6.98,1.9 v4.45,4.44 | GND.1 v95.89,75.56
  other vias: 10.79,66.67 19.69,50.16 59.69,55.24 36.2,61.59 43.81,62.86 74.93,36.83 69.85,9.52 74.3,20.95 46.35,18.09 51.43,40.64 52.7,44.76 32.38,8.25 37.46,8.89 18.42,18.41 29.85,40 27.31,40.64
  pour Top (isolate 0.254): 0.64,76.51 0.64,1.27 arc90 1.27,0.63 99.06,0.63 arc90 99.7,1.27 99.7,78.73 arc90 99.06,79.37 1.27,79.37 arc90 0.64,78.73 0.64,76.83 6.98,76.83 6.98,78.1 arc-90 7.62,78.73 21.59,78.73 arc-90 22.23,78.1 22.23,73.28 arc45 22.41,72.83 38.55,56.7 arc45 39,56.51 49.53,56.51 arc-90 50.16,55.88 50.16,43.18 arc-90 49.53,42.54 17.78,42.54 arc-90 17.15,43.18 17.15,56.25 arc45 16.96,56.7 7.17,66.48 arc-45 6.98,66.93 6.98,76.51
  pour Bottom (isolate 0.254): 0.64,76.51 0.64,1.27 arc90 1.27,0.63 99.06,0.63 arc90 99.7,1.27 99.7,78.73 arc90 99.06,79.37 1.27,79.37 arc90 0.64,78.73 0.64,76.83 6.98,76.83 6.98,78.1 arc-90 7.62,78.73 21.59,78.73 arc-90 22.23,78.1 22.23,73.28 arc45 22.41,72.83 38.55,56.7 arc45 39,56.51 49.53,56.51 arc-90 50.16,55.88 50.16,43.18 arc-90 49.53,42.54 17.78,42.54 arc-90 17.15,43.18 17.15,56.25 arc45 16.96,56.7 7.17,66.48 arc-45 6.98,66.93 6.98,76.51
  pour Bottom (isolate 0.254): 18.23,56.7 arc-45 18.42,56.25 18.42,44.45 arc90 19.05,43.81 48.26,43.81 arc90 48.89,44.45 48.89,54.61 arc90 48.26,55.24 38.68,55.24 arc-45 38.23,55.43 21.46,72.52 arc-45 21.27,72.97 21.27,77.46 arc90 20.64,78.1 8.89,78.1 arc90 8.26,77.46 8.26,66.93 arc45 8.44,66.48
  pour Top (isolate 0.254): 8.89,78.1 arc90 8.26,77.46 8.26,66.93 arc45 8.44,66.48 18.23,56.7 arc-45 18.42,56.25 18.42,44.45 arc90 19.05,43.81 48.26,43.81 arc90 48.89,44.45 48.89,54.61 arc90 48.26,55.24 38.68,55.24 arc-45 38.23,55.43 21.46,72.52 arc-45 21.27,72.97 21.27,77.46 arc90 20.64,78.1
INTSW
  Top 0.813: R15.2 4.45,53.34 6.98,55.88 6.98,63.81 10.16,63.81 | IRQ.1 3.77,63.81 10.16,63.81 | 10.16,63.81 10.2,63.81 IRQ.2
INTSW2
  Top 0.813: IRQ.3 3.17,58.77 3.17,57.78 | 3.17,57.78 3.17,56.51 | R18.1 3.17,57.78
  Bottom 0.61: 10.2,59.37 IRQ.4
  Bottom 0.813: R18.1 7.62,55.88 8.26,55.24 8.26,51.75 9.21,50.8 INTEN.2 | IRQ.3 3.77,59.37 10.2,59.37
LEDTEST
  Top 0.61: DEL.2 11.43,40 9.53,41.91 USAGER.K
MEGAAREF  (via drill 0.71)
  Top 0.61: R3.2 8.57,33.02 AREF.E | AREF.E AREF.S | AREF.E AREF.S | AREF.S v19.05,33.02 | v19.05,45.08 37.46,45.08 | 37.46,45.08 40.64,45.08 41.27,45.72 IC2.32 | CAREF.1 37.46,48.89 37.46,45.08
  Bottom 0.61: v19.05,33.02 v19.05,45.08
MEGAXTAL1
  Bottom 0.61: C2CLKM1.1 Q1.2 53.98,28.57 51.43,31.11 IC2.13
MEGAXTAL2
  Bottom 0.61: IC2.12 48.89,31.11 51.43,28.57 Q1.1 51.56,28.44 53.34,26.66 57.15,26.66 59.05,24.76 C1CLKM1.1
MISO  (via drill 0.71)
  Top 0.61: v37.46,51.43 37.46,62.23 37.46,62.86 37.46,63.5 40.96,66.99 PORTB.7 | ISP.9 22.86,3.8 26.67,3.8 28.58,5.71 40.64,5.71 41.27,6.34 R19.1 | v41.27,22.22 v36.2,27.3
  Bottom 0.61: v37.46,51.43 37.46,45.08 36.2,43.81 IC2.7 v36.2,27.3 | R19.1 v41.27,22.22
MISOUSB
  Bottom 0.61: IC3.18 59.05,19.04 59.05,10.16 60.32,8.89 60.32,4.44 59.69,3.8 48.89,3.8 46.99,5.71 43.18,5.71 41.59,4.12 41.27,3.8 R19.2
MOSI  (via drill 0.71)
  Top 0.61: PORTB.6 39.69,74.92 39.69,68.26 33.66,62.23 33.66,50.8 v34.92,49.53 | v42.54,17.77 v33.66,17.77 26.67,17.77 25.4,16.5 13.97,16.5 13.33,15.87 13.33,5.71 ISP.1
  Bottom 0.61: v34.92,49.53 34.92,45.08 33.66,43.81 IC2.6 v33.66,17.77 | v42.54,17.77 43.81,16.5 R20.1
MOSIUSB
  Bottom 0.61: IC3.17 61.59,19.04 61.59,3.17 60.96,2.54 48.26,2.54 47.62,3.17 47.62,3.8 46.99,4.44 44.45,4.44 43.81,3.8 R20.2
N$8
  Top 0.61: IC3.10 57.78,10.79 59.05,9.52 62.86,9.52 64.14,8.25 Q2.1 67.18,5.08 CCLK2M1.1
N$9
  Top 0.61: CCLK1M1.1 51.75,5.39 53.34,6.98 56.52,6.98 57.78,8.25 | 57.78,8.25 Q2.2 | 57.78,8.25 55.24,10.79 IC3.9
N$12
  Top 0.61: R16.2 75.57,50.16 75.57,52.7 IC4.1
  Top 1.016: IC4.1 IC4.2 IC4.3
N$17
  Bottom 0.61: R6.2 20.32,18.41 17.78,20.95 ETAT.A
N$18
  Top 0.61: IC3.24 36.83,28.57 26.67,28.57 24.77,26.66 24.77,24.76 22.23,22.22 ETAT.K
N$19
  Top 0.61: IC3.23 38.1,29.84 26.04,29.84 22.86,26.66 R6.1
N$20
  Bottom 0.61: R10.2 88.27,55.24 88.27,64.13 87,65.4 81.92,65.4 80.65,64.13 IC4.7
PORTA0
  Bottom 0.61: PORTA.1 12.38,63.81 20.96,55.24 IC2.40
PORTA1
  Bottom 0.61: PORTA.2 13.65,74.92 13.65,64.77 23.5,54.92 IC2.39
PORTA2
  Bottom 0.61: PORTA.3 14.92,65.72 26.04,54.61 IC2.38
PORTA3
  Bottom 0.61: PORTA.4 16.19,74.92 16.19,66.67 28.58,54.61 IC2.37
PORTA4
  Bottom 0.61: IC2.36 31.12,53.97 17.46,67.62 PORTA.5
PORTA5
  Bottom 0.61: PORTA.6 18.73,74.92 18.73,68.57 33.66,53.65 IC2.35
PORTA6
  Bottom 0.61: IC2.34 36.2,50.8 | 36.2,50.8 36.2,51.43 | PORTA.7 20,69.53 36.2,53.34 36.2,50.8
PORTA7
  Bottom 0.61: PORTA.8 21.27,74.92 21.27,70.48 38.73,53.02 IC2.33
PORTB0  (via drill 0.71)
  Top 0.61: PORTB.1 22.23,62.54 v22.23,50.16
  Bottom 0.61: IC2.1 20.96,43.81 22.23,45.08 v22.23,50.16
PORTB1  (via drill 0.71)
  Top 0.61: PORTB.2 34.61,74.92 34.61,72.7 24.77,62.86 v24.77,50.16
  Bottom 0.61: IC2.2 23.5,43.81 24.77,45.08 v24.77,50.16
PORTB2  (via drill 0.71)
  Top 0.61: PORTB.3 35.88,71.43 27.31,62.86 v27.31,50.16
  Bottom 0.61: v27.31,50.16 27.31,45.08 26.04,43.81 IC2.3
PORTB3  (via drill 0.71)
  Top 0.61: PORTB.4 37.15,74.92 37.15,70.48 29.85,63.18 v29.85,50.16
  Bottom 0.61: IC2.4 28.58,43.81 29.85,45.08 v29.85,50.16
PORTB4  (via drill 0.71)
  Top 0.61: PORTB.5 38.42,69.53 32.38,63.5 v32.38,50.16
  Bottom 0.61: IC2.5 31.12,43.81 32.38,45.08 v32.38,50.16
PORTC0  (via drill 0.71)
  Top 0.61: v54.29,66.67 PORTC.1 | IC2.22 66.68,50.16 | 66.68,50.16 65.41,51.43 v65.41,66.67 | MEMEN.1 70.48,50.16 66.68,50.16
  Bottom 0.61: v65.41,66.67 v54.29,66.67
PORTC1  (via drill 0.71)
  Top 0.61: PORTC.2 55.56,74.92 v55.56,61.59 | v64.14,61.59 IC2.23 64.14,46.35 65.41,45.08 R12.2
  Bottom 0.61: 79.38,45.08 R12.2 81.92,45.08 83.19,46.35 83.19,52.7 84.45,53.97 84.45,59.05 85.73,60.32 IC4.5 | v64.14,61.59 v55.56,61.59
PORTC2  (via drill 0.71)
  Top 0.61: IC2.24 v61.59,60.32 | v56.83,60.32 PORTC.3
  Bottom 0.61: v61.59,60.32 v56.83,60.32
PORTC3
  Top 0.61: PORTC.4 58.1,74.92 58.1,49.84 59.05,48.89 IC2.25
PORTC4  (via drill 0.71)
  Top 0.61: v59.37,57.78 PORTC.5 | IC2.26 v56.52,57.78
  Bottom 0.61: v56.52,57.78 v59.37,57.78
PORTC5  (via drill 0.71)
  Top 0.61: PORTC.6 60.64,74.92 v60.64,62.86 | IC2.27 v53.98,62.86
  Bottom 0.61: v53.98,62.86 v60.64,62.86
PORTC6  (via drill 0.71)
  Top 0.61: v61.91,65.4 PORTC.7 | IC2.28 v51.43,65.4
  Bottom 0.61: v51.43,65.4 v61.91,65.4
PORTC7  (via drill 0.71)
  Top 0.61: PORTC.8 63.18,74.92 v63.18,64.13 | v50.16,64.13 50.16,50.16 48.89,48.89 IC2.29
  Bottom 0.61: v50.16,64.13 v63.18,64.13
PORTD0  (via drill 0.71)
  Top 0.61: PORTD.1 75.25,73.97 v66.68,65.4 | v32.38,38.73 v55.24,38.73
  Bottom 0.61: IC2.14 53.98,33.65 55.24,34.92 v55.24,38.73 55.24,53.97 57.78,56.51 61.59,56.51 66.68,61.59 v66.68,65.4 | DBGEN.2 v32.38,38.73
PORTD1  (via drill 0.71)
  Top 0.61: PORTD.2 76.52,74.92 76.52,72.7 75.88,72.07 75.57,72.07 v67.95,64.45 | v27.31,36.19 v57.78,36.19
  Bottom 0.61: v67.95,64.45 67.95,61.59 57.78,51.43 v57.78,36.19 57.78,34.92 56.52,33.65 IC2.15 | R5.2 30.8,2.54 30.16,3.17 30.16,22.54 27.31,25.39 v27.31,36.19
PORTD2  (via drill 0.71)
  Top 0.61: PORTD.3 77.79,72.7 69.22,64.13 v69.22,62.86 | v12.06,43.81 13.33,42.54 v60.32,42.54
  Bottom 0.61: IC2.16 59.05,33.65 60.32,34.92 60.32,40 v60.32,42.54 60.32,52.7 69.22,61.59 v69.22,62.86 | v12.06,43.81 INTEN.1
PORTD3  (via drill 0.71)
  Top 0.61: PORTD.4 79.06,74.92 79.06,72.07 70.48,63.5 v70.48,61.59
  Bottom 0.61: v70.48,61.59 62.86,53.97 62.86,34.92 61.59,33.65 IC2.17
PORTD4  (via drill 0.71)
  Top 0.61: PORTD.5 80.33,71.43 71.76,62.86 71.76,60.64 v70.17,59.05
  Bottom 0.61: IC2.18 64.14,33.65 65.41,34.92 65.41,55.24 69.22,59.05 v70.17,59.05
PORTD5  (via drill 0.71)
  Top 0.61: PORTD.6 81.6,74.92 81.6,70.8 73.03,62.23 73.03,60.32 v69.22,56.51
  Bottom 0.61: v69.22,56.51 67.95,55.24 67.95,34.92 66.68,33.65 IC2.19
PORTD6  (via drill 0.71)
  Top 0.61: PORTD.7 82.87,70.16 75.57,62.86 75.57,60.32 v71.76,56.51
  Bottom 0.61: IC2.20 69.22,33.65 70.48,34.92 70.48,48.89 69.22,50.16 69.22,53.97 v71.76,56.51
PORTD7
  Top 0.61: PORTD.8 84.14,74.92 84.14,68.89 79.38,64.13 79.38,59.05 73.03,52.7 73.03,48.89 71.76,47.62 IC2.21
PRGRESET
  Top 0.61: PROGSEL.3 22.23,13.97 CRESM1.2 R22.1 33.66,10.16 34.92,11.43 IC3.1
PWRLED
  Top 1.016: ALIM.A 81.92,29.84 R1.1
RXD
  Bottom 0.61: IC3.2 37.46,11.74 R5.1
SCK  (via drill 0.71)
  Top 0.61: PORTB.8 42.23,74.92 42.23,66.67 41.27,65.72 v41.27,60.32 | ISP.7 20.96,5.71 26.04,5.71 27.31,6.98 38.1,6.98 38.73,7.62 38.73,8.25 R17.1
  Bottom 0.61: v41.27,60.32 41.27,50.8 42.54,49.53 42.54,45.72 41.91,45.08 40,45.08 38.73,43.81 IC2.8 38.73,31.11 39.37,30.47 42.54,30.47 43.18,29.84 43.18,27.3 38.73,22.86 R17.1
SCKUSB  (via drill 0.71)
  Top 0.61: v52.7,8.25 52.7,10.16 53.98,11.43 53.98,13.97 55.24,15.24 v56.52,15.24
  Bottom 0.61: IC3.19 56.52,19.04 v56.52,15.24 | v52.7,8.25 51.43,6.98 41.91,6.98 38.73,3.8 R17.2
SCL
  Bottom 0.61: IC4.6 81.92,61.59 81.92,51.43 80.65,50.16 R11.2
  Bottom 1.016: R11.2 75.57,50.16 MEMEN.2
SYSRST  (via drill 0.71)
  Top 0.61: ISP.5 18.42,5.71 PROGSEL.2 18.42,13.97 19.69,15.24 26.04,15.24 27.31,16.5 v46.35,16.5
  Bottom 0.61: v46.35,16.5 R21.2
TARGETRESET  (via drill 0.71)
  Top 0.61: IC2.9 41.27,33.65 40,34.92 23.5,34.92 22.23,33.65 v22.23,29.84
  Bottom 0.61: v22.23,29.84 19.69,29.84 10.16,20.31 10.16,19.68 10.24,19.76 RESET.1 | R2.2 3.17,19.4 RESET.2 RESET.1 | PROGSEL.1 15.88,19.04 14.96,19.96 RESET.1
TL3
  Top 0.61: DEL.1 15.88,38.1 10.16,38.1 R7.2
TX
  Bottom 0.61: R4.2 31.75,24.76 DBGEN.1
TXD
  Top 0.61: IC3.3 40,14.6 31.75,14.6 R4.1
USB+  (via drill 0.71)
  Top 0.61: v67.95,16.5 54.61,16.5 53.34,15.24 43.18,15.24 42.54,14.6 IC3.4
  Top 1.016: IC3.4 42.54,13.33
  Bottom 1.016: IC3.15 v67.95,16.5 68.58,15.87 R14.2
USB-
  Bottom 0.61: R13.2 68.58,11.43 67.95,12.06 IC3.14
VCC  (via drill 0.71, 0.81)
  Top 0.61: L1.2 46.35,74.92 CB.1 | R11.1 83.19,52.7 R10.1 | v7.62,22.22 7.62,18.41 8.26,17.77 R2.1 15.88,17.77 18.42,20.31 22.86,20.31 26.67,24.12 D5.C
  Top 0.813: C-FIL.1 92.71,67.3 92.71,75.56 CD.1 | CC.1 66.68,74.29 v66.68,69.21
  Top 1.016: CM1.1 43.81,31.11 IC2.10 43.81,33.65 44.77,34.6 72.07,34.6 73.03,33.65 C-RES.+ 73.03,24.76 74.93,22.86 78.11,22.86 78.74,22.22 R1.2
  Top 1.422: C-FIL.1 97.79,62.23 97.79,41.27 96.52,40 93.25,40 IC1.1 91.34,41.91 v92.71,41.91
  Bottom 0.61: PORTB.10 47.62,76.19 CB.1 | R11.1 87,50.16 88.27,48.89 88.27,46.35 87,45.08 R12.1 85.73,43.18 | R15.1 10.79,43.18 11.43,42.54 11.43,38.1 12.7,36.83 12.7,34.92 11.43,33.65 11.43,30.47 7.62,26.66 v7.62,22.22
  Bottom 0.813: PORTA.10 26.67,76.19 CA.1 28.89,78.42 48.89,78.42 | PORTC.10 68.58,76.19 CC.1 69.85,78.42 | PORTD.10 89.54,76.19 CD.1 89.85,78.42 69.85,78.42 | 69.85,78.42 48.89,78.42 | 48.89,78.42 CB.1 | v66.68,69.21 74.3,62.23 CMEM.1 76.84,61.59 IC4.8
  Bottom 1.016: C-FIL.1 89.54,57.78 89.54,44.45 88.27,43.18 85.73,43.18 76.2,43.18 73.03,40 C-RES.+ | D5.C 36.83,24.44 CM1.1
VIN+
  Top 1.016: X1.+ 85.73,26.93 85.73,31.11 83.82,33.02 D1.AC2
VIN-
  Top 1.016: X1.C 84.95,35.55 80.01,35.55 78.74,34.29 D1.AC1
  Bottom 1.016: X1.- 88.95,29.71 X1.C
VTG
  Top 1.016: ISP.2 10.16,8.89 VTG.1
VUNREG  (via drill 0.81)
  Top 1.016: IC1.2 95.89,42.45 v95.89,43.81
  Bottom 1.016: C-TAMP.+ 95.89,55.75 v95.89,43.81 95.89,37.46 OFF/ON.3

### Text on the board
Top: TOP
Bottom: Titre: Carte Mère | Auteur: Matthew Khouzam | Bottom | Layer:
Dimension: Titre: Carte Mère | Auteur: Matthew Khouzam | Layer:
tPlace: 3
tStop: Titre: Carte Mère | Auteur: Matthew Khouzam | Layer: | Solder Mask Component
bStop: Titre: Carte Mère | Auteur: Matthew Khouzam | Solder mask Solder | Layer:
Drills: Drills & Mesures
outline: Board Outline
Silkscreen: Silkscreen
Text: 100n | 100n | 100n | 100n | GND | PORTA | PORTB | PORTC | PORTD | Interrupt | Mémoire | 1u | 10u | Génie | 24CXXX | 220u | 100n | informatique | 1M | MémEN | 10K | et génie | 100n | 100n | 10K | Ver: 1.1 | 2012 | logiciel | IntEN | 10K | Del | libre | 10K | Régul. | 10K | + | - | ATMEGA 16/32/164p/324p/644p | Alimentation | 1K5 | OFF/ON | AREF | 10K | Alim | 100n | 330u | Reset | État | 18p | 1K5 | DbgEN | 100n | 18p | 1K5 | 1M | 10K | ATMEGA8/88 | 10K | 68 | 100n | 100n | 68 | VtgEN | PrgSEL | Prog | 1K5 | 10K | 10K | 10K | 10K | 1K5 | 10K | 18p | 12MHz | 18p | USB-ASP | Matthew Khouzam / | Jérôme Collin | ISP-10
_tNames: GND | PORTA | PORTB | PORTC | PORTD | IRQ | IC4 | C-TAMP | MEMEN | INTEN | DEL | USAGER | IC1 | ON/OFF | D1 | AREF | ALIM | RESET | ETAT | DBGEN | C-RES | ISP | VTG | PRGSEL | USB